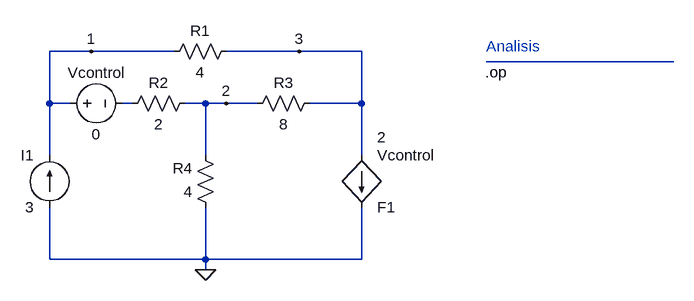
[diagram p0: schematic ejemplo1_voltajes_nodos.asc]
ejemplo1_voltajes_nodos.asc, the LTspice schematic file:
Version 4
SHEET 1 880 680
WIRE -224 32 -288 32
WIRE -96 32 -224 32
WIRE 96 32 -16 32
WIRE 192 32 96 32
WIRE 672 48 384 48
WIRE -288 112 -288 32
WIRE -256 112 -288 112
WIRE -160 112 -176 112
WIRE -48 112 -80 112
WIRE -16 112 -48 112
WIRE 32 112 -16 112
WIRE 192 112 192 32
WIRE 192 112 112 112
WIRE -288 192 -288 112
WIRE -48 192 -48 112
WIRE 192 192 192 112
WIRE -288 352 -288 272
WIRE -48 352 -48 272
WIRE -48 352 -288 352
WIRE 192 352 192 272
WIRE 192 352 -48 352
WIRE -48 368 -48 352
FLAG -48 368 0
FLAG -224 32 1
FLAG 96 32 3
FLAG -16 112 2
SYMBOL f 192 192 R0
WINDOW 0 24 80 Left 2
WINDOW 3 24 0 Left 2
WINDOW 123 24 -28 Left 2
SYMATTR InstName F1
SYMATTR Value Vcontrol
SYMATTR Value2 2
SYMBOL current -288 272 R180
WINDOW 0 24 80 Left 2
WINDOW 3 24 0 Left 2
WINDOW 123 0 0 Left 0
WINDOW 39 0 0 Left 0
SYMATTR InstName I1
SYMATTR Value 3
SYMBOL res 0 16 R90
WINDOW 0 0 56 VBottom 2
WINDOW 3 32 56 VTop 2
SYMATTR InstName R1
SYMATTR Value 4
SYMBOL res -64 96 R90
WINDOW 0 0 56 VBottom 2
WINDOW 3 32 56 VTop 2
SYMATTR InstName R2
SYMATTR Value 2
SYMBOL res 128 96 R90
WINDOW 0 0 56 VBottom 2
WINDOW 3 32 56 VTop 2
SYMATTR InstName R3
SYMATTR Value 8
SYMBOL res -32 288 R180
WINDOW 0 36 76 Left 2
WINDOW 3 36 40 Left 2
SYMATTR InstName R4
SYMATTR Value 4
SYMBOL voltage -272 112 R270
WINDOW 0 32 56 VTop 2
WINDOW 3 -32 56 VBottom 2
SYMATTR InstName Vcontrol
SYMATTR Value 0
TEXT 382 64 Left 2 !.op
TEXT 384 24 Left 2 ;Analisis

The netlist it stands for:
* ejemplo1_voltajes_nodos.asc
F1 3 0 Vcontrol 2
I1 0 1 3
R1 3 1 4
R2 2 N002 2
R3 3 2 8
R4 0 2 4
Vcontrol 1 N002 0
.op
* Analisis
.backanno
.end